# EAGLE design SMDschemtatic (EAGLE 9.4.2)
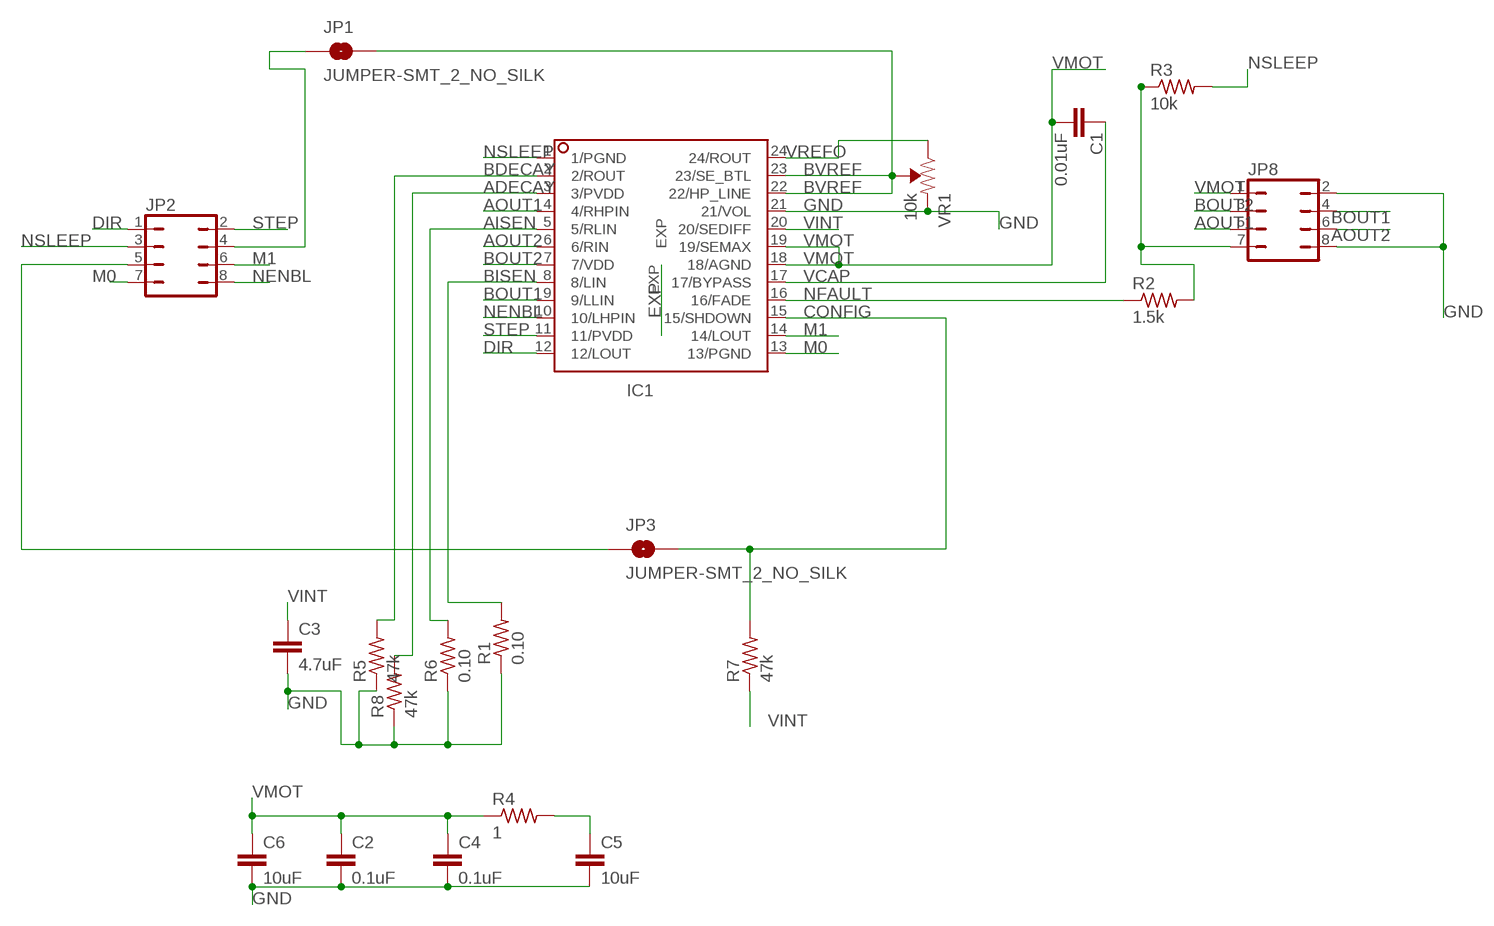
[diagram p0: schematic, sheet 1]

## Parts
C1  0.01uF  10NF-0603-50V-10%  [0603]
C2  0.1uF  10NF-0603-50V-10%  [0603]
C3  4.7uF  10NF-0603-50V-10%  [0603]
C4  0.1uF  10NF-0603-50V-10%  [0603]
C5  10uF  10NF-0603-50V-10%  [0603]
C6  10uF  10NF-0603-50V-10%  [0603]
IC1  PA3011  [HTSSOP24]
JP1  JUMPER-SMT_2_NO_SILK  [SMT-JUMPER_2_NO_SILK]
JP2  JP4Q  [JP4Q]
JP3  JUMPER-SMT_2_NO_SILK  [SMT-JUMPER_2_NO_SILK]
JP8  JP4Q  [JP4Q]
R1  0.10  R-US_R2512  [R2512]
R2  1.5k  R-US_R2512  [R2512]
R3  10k  R-US_R2512  [R2512]
R4  1  R-US_R2512  [R2512]
R5  47k  R-US_R2512  [R2512]
R6  0.10  R-US_R2512  [R2512]
R7  47k  R-US_R2512  [R2512]
R8  47k  R-US_R2512  [R2512]
VR1  10k  TRIMPOT-SMD-3MM-CLOSED-1/8W-20%  [TRIMPOT-SMD-3MM-CLOSED]

## Nets
ADECAY: IC1.3(3/PVDD) R8.2
AISEN: IC1.5(5/RLIN) R6.2
AOUT1: IC1.4(4/RHPIN) JP8.5
AOUT2: IC1.6(6/RIN) JP8.6
BDECAY: IC1.2(2/ROUT) R5.2
BISEN: IC1.8(8/LIN) R1.2
BOUT1: IC1.9(9/LLIN) JP8.4
BOUT2: IC1.7(7/VDD) JP8.3
BVREF: IC1.22(22/HP_LINE) IC1.23(23/SE_BTL) JP1.2 VR1.2(WIPER)
CONFIG: IC1.15(15/SHDOWN) JP3.2 R7.2
DIR: IC1.12(12/LOUT) JP2.1
EXP: IC1.EXP
GND: C2.2 C3.2 C4.2 C5.2 C6.2 IC1.21(21/VOL) JP8.2 JP8.8 R1.1 R5.1 R6.1 R8.1 VR1.1(CCW)
M0: IC1.13(13/PGND) JP2.7
M1: IC1.14(14/LOUT) JP2.6
N$1: JP2.5 JP3.1
N$2: JP8.7 R2.2 R3.1
N$3: JP1.1 JP2.4
N$5: C5.1 R4.2
NENBL: IC1.10(10/LHPIN) JP2.8
NFAULT: IC1.16(16/FADE) R2.1
NSLEEP: IC1.1(1/PGND) JP2.3 R3.2
STEP: IC1.11(11/PVDD) JP2.2
VCAP: C1.1 IC1.17(17/BYPASS)
VINT: C3.1 IC1.20(20/SEDIFF) R7.1
VMOT: C1.2 C2.1 C4.1 C6.1 IC1.18(18/AGND) IC1.19(19/SEMAX) JP8.1 R4.1
VREFO: IC1.24(24/ROUT) VR1.3(CW)

## Library data of the parts
C1-C6 = SparkFun-Capacitors:10NF: 0.01uF/10nF/10,000pF ceramic capacitors A capacitor is a passive two-terminal electrical component used to store electrical energy temporarily in an electric field. CAP-09321; PROD_ID: CAP-00867; VALUE: 10nF
IC1 = alphapower:PA3011: UNISONIC TECHNOLOGIES As a stereo audio speaker which is operating on a single 5.5V supply, the UTC PA3011 is capable of delivering 3W of output power per channel into 3Ω loads with less than 10% THD+N. The speaker volume level is adjusted by applying a dc voltage to the VOLUME terminal. When a dc voltage is applied, to avoid an unexpected high volume level through the headphones, a third terminal, SEMAX, limits the headphone volume level. And also a fade mode ramps the volume up and down to ensure a smooth transition between active and shutdown modes,. The UTC PA3011 can be applicatated in notebook, LCD monitors and pocket PC.
JP1 JP3 = SparkFun-Jumpers:JUMPER-SMT_2_NO: Normally open jumper This jumper has two pads in close proximity to each other. Apply solder to close the connection. Round pads are easier to solder for beginners, but are a lot larger. SparkFun Product that uses the round pads: SparkFun EL Sequencer <https://www.sparkfun.com/products/12781>
JP2 JP8 = jumper:JP4Q: JUMPER
R1-R8 = resistor:R-US_: RESISTOR, American symbol
VR1 = SparkFun-Resistors:TRIMPOT: Trimming Potentiometer (Trimpot) Three-terminal potentiometers, with an adjustable wiper and two adjustable resistors. A pot can be used to create a configurable voltage divider, or as a variable resistor. "Trimpots" are a subset of potentiometers, usually intended for "set-and-forget" applications. They're often more delicate than standard potentiometers - rated for fewer turns. Variants PTH-KNOB - PTH Trimpot w/ finger-adjustable knob Trimpot 10K with Knob <https://www.sparkfun.com/products/9806> (COM-09806) Datasheet <http://www.sparkfun.com/datasheets/Components/General/TSR-3386.pdf> SMD-3MM-CLOSED-FRAME - SMD 3mm Square Closed-Frame Trimpot Used on e.g. EasyDriver - Stepper Motor Driver <https://www.sparkfun.com/products/12779> Datasheet <http://www.bitechnologies.com/pdfs/22.pdf> (22AR10KTR) SMD-5MM - SMD 5mm Square Closed-Frame Trimpot Used on e.g. IOIO-OTG - V2.2 <https://www.sparkfun.com/products/13613> Datasheet <http://www.vishay.com/docs/51008/ts53.pdf> (TS53YL502MR10) SMD-3MM-1/10W-25% - 3mm Square Open-Frame Trimpot Used on e.g. SparkFun Shapeoko <https://www.sparkfun.com/products/13899> Datasheet <http://www.bourns.com/docs/Product-Datasheets/TC33.pdf> (TC33X-2-103E); PROD_ID: RES-09285

## Board
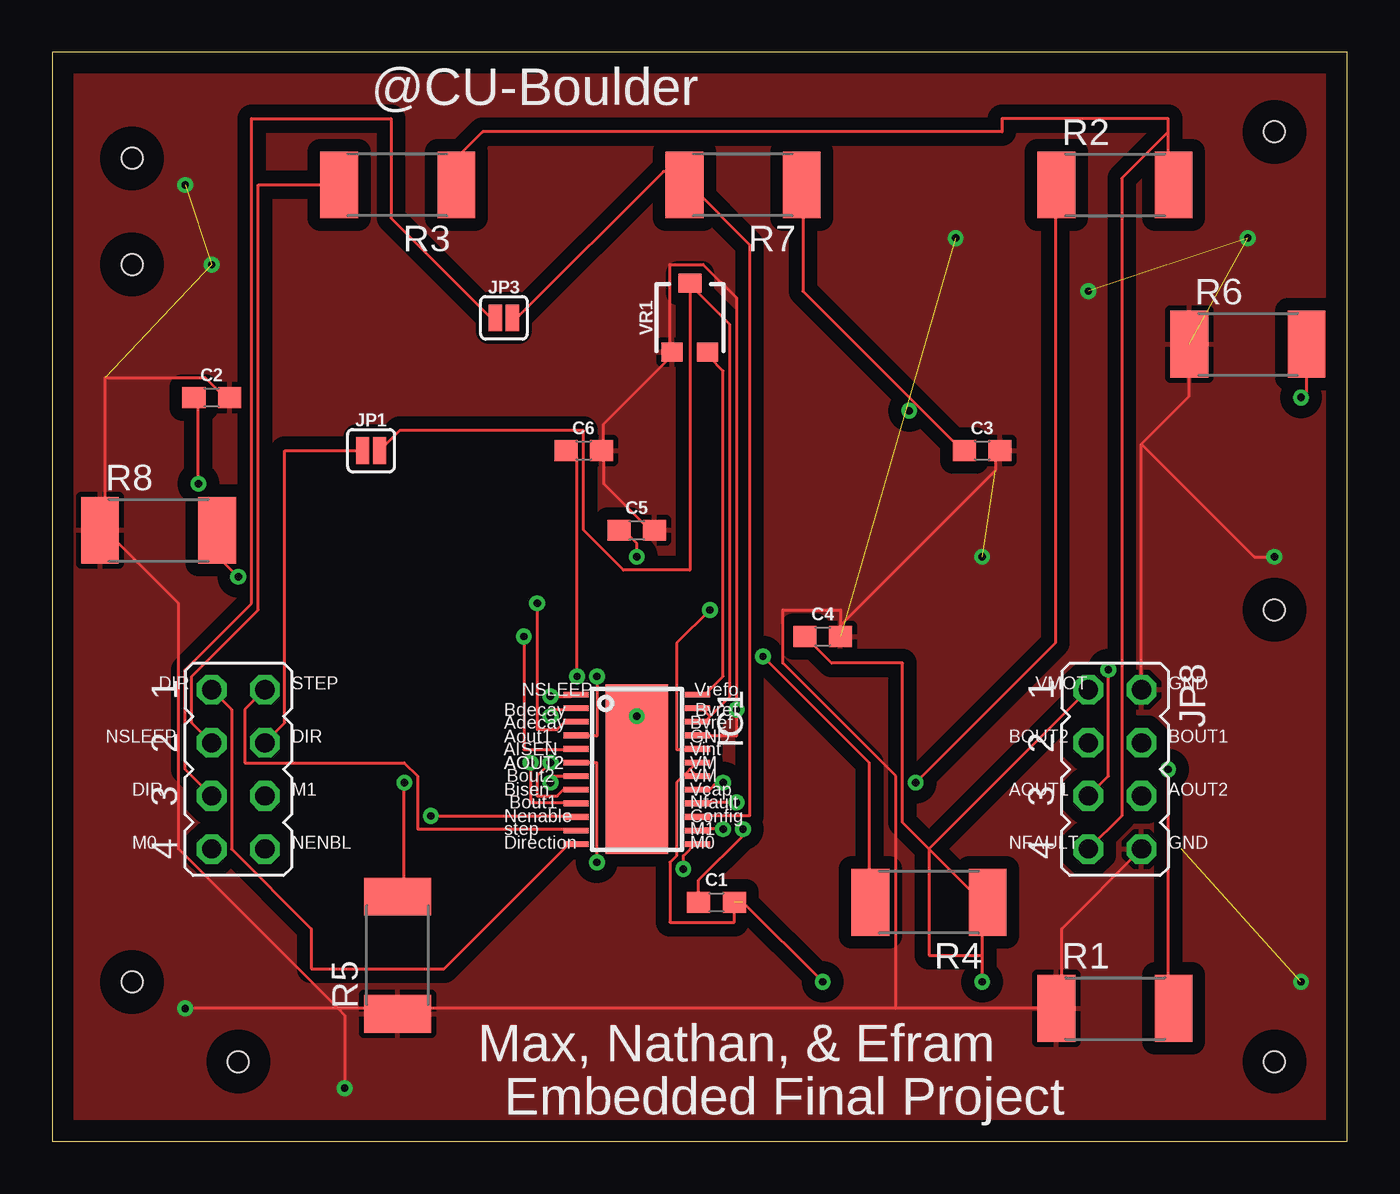
[diagram p1: board, top side]
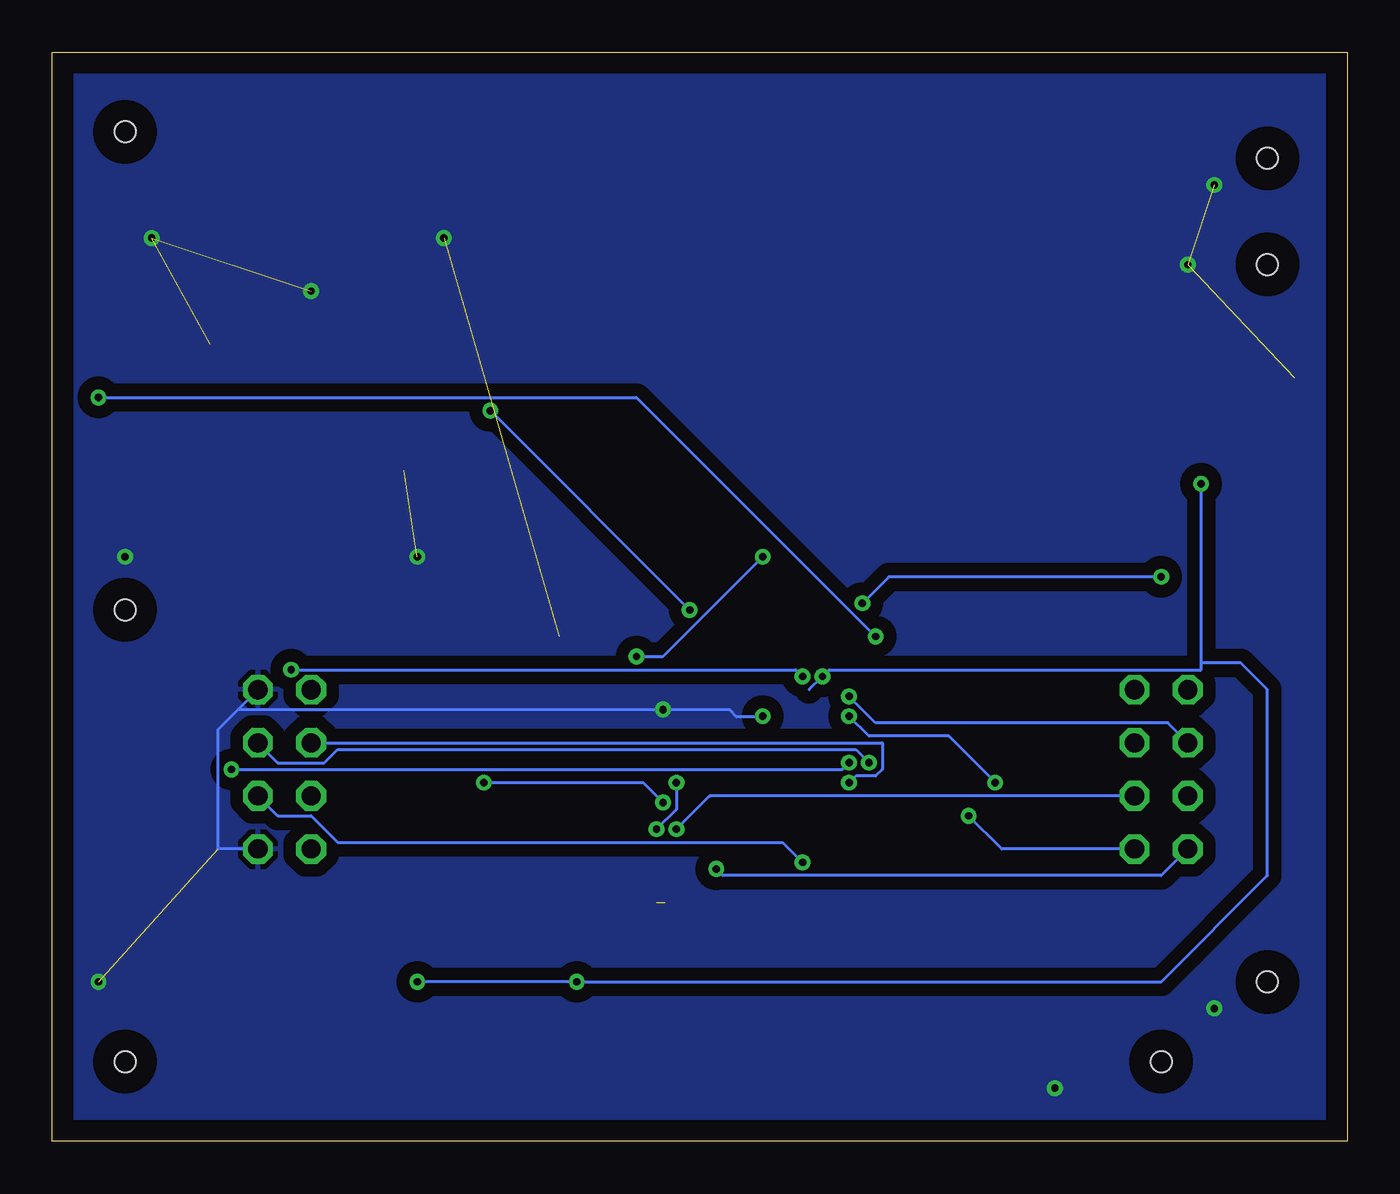
[diagram p2: board, bottom side, seen from below]

Size 61.9 x 52.06 mm. Coordinates in mm from the lower left corner, seen from the top.
Outline: 0,0 61.9,0 61.9,52.06 0,52.06 0,0
Copper layers (1*16): Top 0.035mm / dielectric 1.5mm / Bottom 0.035mm
Design rules "default": minimum track width 6mil, minimum drill 0.35mm, track to track 6mil, track to pad 6mil, pad to pad 6mil, via to via 6mil, smd to smd 6mil, copper to edge 40mil, drill to drill 6mil, minimum pad ring 10mil, minimum via ring 8mil, stop-mask expansion 4mil, vias tented up to drill 0mil, thermal gap 10mil
Holes 1 mm at 3.81,46.99 58.42,25.4 8.89,3.81 3.81,41.91 58.42,3.81 3.81,7.62 58.42,48.26

### Footprints (pad centres in the part's own frame; a part is rotated, then mirrored left to right if it is on the bottom)
0603 = smd 1.1 x 1: 1 -0.85,0; 2 0.85,0
HTSSOP24 = smd 0.27 x 1.2: 1 -3.575,-2.9; 2 -2.925,-2.9; 3 -2.275,-2.9; 4 -1.625,-2.9; 5 -0.975,-2.9; 6 -0.325,-2.9; 7 0.325,-2.9; 8 0.975,-2.9; 9 1.625,-2.9; 10 2.275,-2.9; 11 2.925,-2.9; 12 3.575,-2.9; 13 3.575,2.9; 14 2.925,2.9; 15 2.275,2.9; 16 1.625,2.9; 17 0.975,2.9; 18 0.325,2.9; 19 -0.325,2.9; 20 -0.975,2.9; 21 -1.625,2.9; 22 -2.275,2.9; 23 -2.925,2.9; 24 -3.575,2.9 | smd 8.1 x 3: EXP 0,0
SMT-JUMPER_2_NO_SILK = smd 0.635 x 1.27: 1 -0.406,0; 2 0.406,0
JP4Q = drill 0.914 octagon: 1 -3.81,-1.27; 2 -3.81,1.27; 3 -1.27,-1.27; 4 -1.27,1.27; 5 1.27,-1.27; 6 1.27,1.27; 7 3.81,-1.27; 8 3.81,1.27
R2512 = smd 1.8 x 3.2: 1 -2.8,0; 2 2.8,0
TRIMPOT-SMD-3MM-CLOSED = smd 1 x 0.9: 1 -0.85,-1.65; 3 0.85,-1.65 | smd 1.1 x 0.9: 2 0,1.65

### Placement (x,y rotation side)
C1  31.75,11.43 0 top
C2  7.62,35.56 0 top
C3  44.45,33.02 0 top
C4  36.83,24.13 0 top
C5  27.94,29.21 0 top
C6  25.4,33.02 0 top
IC1  27.94,17.78 270 top
JP1  15.24,33.02 0 top
JP2  8.89,17.78 270 top
JP3  21.59,39.37 0 top
JP8  50.8,17.78 270 top
R1  50.8,6.35 0 top
R2  50.8,45.72 0 top
R3  16.51,45.72 180 top
R4  41.91,11.43 180 top
R5  16.51,8.89 90 top
R6  57.15,38.1 0 top
R7  33.02,45.72 180 top
R8  5.08,29.21 0 top
VR1  30.48,39.37 0 top

### Tracks (layer width: path | path; a pad name or v marks a point on that pad's centre or on a via)
ADECAY  (via drill 0.35)
  Top 0.152: v23.18,25.72 23.18,19.69 24.13,19.69 24.45,20 24.77,20 IC1.3 | v8.89,26.99 7.94,27.94 7.94,29.21 R8.2
  Bottom 0.152: v23.18,25.72 21.91,26.99 v8.89,26.99
AISEN  (via drill 0.35)
  Top 0.152: v22.54,24.13 22.54,18.73 24.77,18.73 IC1.5 | R6.2 59.95,35.82 v59.69,35.56
  Bottom 0.152: v22.54,24.13 33.97,35.56 v59.69,35.56
AOUT1  (via drill 0.35)
  Top 0.152: v26.04,22.23 26.04,19.37 25.08,19.37 IC1.4 | v50.48,22.54 50.48,17.46 JP8.5
  Bottom 0.152: v26.04,22.23 26.35,22.54 v50.48,22.54
AOUT2  (via drill 0.35)
  Top 0.152: v26.04,13.34 26.04,18.1 25.08,18.1 IC1.6
  Bottom 0.152: v26.04,13.34 26.99,14.29 48.26,14.29 49.53,15.56 51.12,15.56 JP8.6
BDECAY  (via drill 0.35)
  Top 0.152: v23.81,20.32 23.81,20.64 24.77,20.64 IC1.2 | v16.83,17.15 16.83,11.75 R5.2
  Bottom 0.152: v23.81,20.32 22.86,19.37 19.05,19.37 v16.83,17.15
BISEN  (via drill 0.35)
  Top 0.152: v23.81,18.1 23.18,17.46 23.18,16.51 24.13,16.51 24.45,16.83 24.77,16.83 IC1.8 | v53.34,17.78 53.34,6.35 R1.2
  Bottom 0.152: v23.81,18.1 24.13,17.78 v53.34,17.78
BOUT1  (via drill 0.35)
  Top 0.152: v22.86,18.1 22.86,16.19 24.77,16.19 IC1.9
  Bottom 0.152: v22.86,18.1 23.49,18.73 48.26,18.73 48.9,18.1 51.12,18.1 JP8.4
BOUT2  (via drill 0.35)
  Top 0.152: v23.81,17.15 23.81,17.46 24.77,17.46 IC1.7
  Bottom 0.152: v23.81,17.15 23.49,17.46 22.54,17.46 22.23,17.78 22.23,19.05 JP8.3
BVREF
  Top 0.152: 30.48,40.96 32.38,39.05 32.38,21.27 31.43,20.32 | 31.43,20.32 31.12,20 IC1.22 | 31.43,20.32 31.12,20.64 IC1.23 | 30.48,40.96 30.48,27.3 27.3,27.3 25.4,29.21 25.4,33.97 16.6,33.97 JP1.2 | 30.48,40.96 VR1.2
CONFIG
  Top 0.152: IC1.15 31.12,15.56 33.34,15.56 33.34,42.86 30.48,45.72 R7.2 30.16,45.72 30.16,46.35 29.21,46.35 22.23,39.37 JP3.2
DIR
  Top 0.152: JP2.1 8.57,20.64 8.57,13.97 12.38,10.16 12.38,8.25 18.73,8.25 24.77,14.29 IC1.12
GND  (via drill 0.35)  (7 unrouted)
  Top 0.152: 26.35,33.02 26.35,34.29 29.53,37.46 VR1.1 29.53,37.78 29.53,41.91 31.12,41.91 32.7,40.32 v32.7,20.64 32.7,19.37 31.12,19.37 IC1.21 | 26.35,33.02 26.35,31.43 28.58,29.21 C5.2 | 26.35,33.02 C6.2 | 2.54,29.21 2.54,36.51 7.3,36.51 8.25,35.56 C2.2 | C3.2 45.09,33.02 45.09,32.07 37.68,24.66 C4.2 37.68,25.4 34.92,25.4 34.92,22.86 40.32,17.46 40.32,6.35 | JP8.8 48.26,10.16 48.26,6.35 R1.1 40.32,6.35 | 40.32,6.35 16.51,6.35 R5.1 16.19,6.35 13.65,6.35 | 52.07,33.34 54.35,35.62 R6.1 | JP8.2 52.07,33.34 | 2.54,29.21 6.03,25.72 6.03,13.97 13.65,6.35 | 2.54,29.21 R8.1 | 13.65,6.35 13.97,6.03 v13.97,2.54 | 13.65,6.35 v6.35,6.35 | 52.07,33.34 57.47,27.94 v58.42,27.94
  Bottom 0.152: 53.02,20.64 53.98,19.69 53.98,13.97 JP8.8 | 53.02,20.64 JP8.2 | 53.02,20.64 v32.7,20.64 29.53,20.64 29.21,20.32 27.94,20.32
  other vias: 59.69,7.62 7.62,41.91 6.35,45.72 44.45,27.94 43.18,43.18 57.15,43.18 49.53,40.64
  pour Bottom (isolate 0.61): 0,52.07 62.23,52.07 62.23,0 0,0
  pour Top (isolate 0.61): 0,52.07 62.23,52.07 62.23,0 0,0
M0  (via drill 0.35)
  Top 0.152: v30.16,13.02 30.16,13.65 30.8,14.29 IC1.13
  Bottom 0.152: v30.16,13.02 29.84,12.7 8.89,12.7 JP2.7
M1  (via drill 0.35)
  Top 0.152: v32.07,14.92 31.12,14.92 IC1.14
  Bottom 0.152: v32.07,14.92 30.48,16.51 JP2.6
N$1
  Top 0.152: JP2.5 6.35,17.78 6.35,22.54 9.52,25.72 9.52,48.26 9.52,48.9 16.19,48.9 16.19,44.13 20.95,39.37 JP3.1
N$2
  Top 0.152: JP8.7 51.12,15.56 51.12,46.04 53.34,48.26 | R3.1 19.31,46.99 20.58,48.26 45.4,48.26 45.4,48.9 53.34,48.9 53.34,45.72 R2.2
N$3
  Top 0.152: JP2.4 11.11,20 11.11,33.02 JP1.1
N$4  (via drill 0.35)
  other vias: 27.94,20.32
N$5  (via drill 0.35)
  Top 0.152: v27.94,27.94 27.94,28.58 27.3,29.21 C5.1 | v33.97,23.18 39.05,18.1 39.05,11.43 R4.2
  Bottom 0.152: v27.94,27.94 32.7,23.18 v33.97,23.18
NENBL  (via drill 0.35)
  Top 0.152: v18.1,15.56 24.77,15.56 IC1.10
  Bottom 0.152: v18.1,15.56 16.51,13.97 JP2.8
NFAULT  (via drill 0.35)
  Top 0.152: v32.7,16.19 31.12,16.19 IC1.16 | v41.27,17.15 47.94,23.81 47.94,45.72 R2.1
  Bottom 0.152: v32.7,16.19 33.66,17.15 v41.27,17.15
NSLEEP  (via drill 0.35)
  Top 0.152: v23.81,21.27 24.77,21.27 IC1.1 | JP2.3 6.67,20 6.67,22.23 9.84,25.4 9.84,45.72 R3.2
  Bottom 0.152: v23.81,21.27 22.54,20 8.57,20 JP2.3
STEP
  Top 0.152: JP2.2 9.21,20.64 9.21,18.1 16.83,18.1 17.46,17.46 17.46,14.92 24.77,14.92 IC1.11
VCAP  (via drill 0.35)
  Top 0.152: C1.1 30.9,12.48 33.02,14.6 v33.02,14.92 | v32.07,17.15 31.75,17.15 31.43,16.83 31.12,16.83 IC1.17
  Bottom 0.152: v33.02,14.92 32.07,15.88 v32.07,17.15
VINT  (via drill 0.35)
  Top 0.152: 41.27,35.24 35.88,40.64 35.88,45.72 R7.1 | 41.27,35.24 43.5,33.02 C3.1 | v31.43,25.4 29.84,23.81 29.84,18.73 30.8,18.73 IC1.20 | 41.27,35.24 v40.96,34.92
  Bottom 0.152: v40.96,34.92 v31.43,25.4
VMOT  (via drill 0.35)  (1 unrouted)
  Top 0.152: 41.91,13.97 44.45,11.43 R4.1 | 41.91,13.97 40.64,15.24 40.64,22.86 37.25,22.86 C4.1 | v25.08,22.23 25.08,32.7 24.77,33.02 C6.1 | v6.98,31.43 6.98,35.56 C2.1 | 30.48,17.78 30.8,18.1 IC1.19 | 30.48,17.78 29.84,17.15 29.84,13.65 29.53,13.34 29.53,10.48 32.6,10.48 C1.2 | 30.48,17.78 30.8,17.46 IC1.18 | 41.91,13.97 JP8.1 | v36.83,7.62 33.02,11.43 | v44.45,7.62 44.45,8.89 | 44.45,8.89 44.45,10.16 | 41.91,13.97 41.91,8.89 44.45,8.89
  Bottom 0.152: 25.72,21.59 v25.08,22.23 24.77,22.54 6.98,22.54 6.98,22.86 | 6.98,22.86 v6.98,31.43 | v44.45,7.62 v36.83,7.62 8.89,7.62 3.81,12.7 3.81,21.59 5.08,22.86 6.98,22.86
VREFO
  Top 0.152: VR1.3 31.43,37.46 32.07,36.83 32.07,22.23 31.12,21.27 IC1.24

### Text on the board
tNames: NSLEEP | DIR | M0
_tNames: @CU-Boulder | DIR | STEP | NSLEEP | Vrefo | VMOT | GND | Adecay | Bdecay | Bvref | Bvref | DIR | Aout1 | AISEN | GND | Vint | BOUT2 | BOUT1 | AOUT2 | AOUT2 | Bout2 | VM | VM | M1 | Bisen | Bout1 | Nfault | Vcap | AOUT1 | AOUT2 | Nenable | step | Config | M1 | NENBL | Direction | M0 | NFAULT | GND | Max, Nathan, & Efram | Embedded Final Project